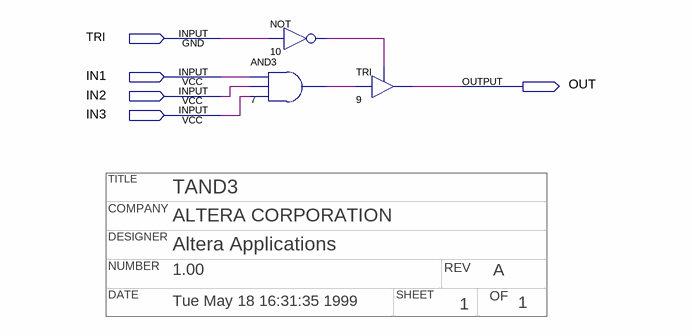
[diagram p0: schematic sheet]
// Quartus schematic tand3.bdf as structural Verilog: 3 symbols, 5 pins
// Title block: TITLE: TAND3; COMPANY: ALTERA CORPORATION; DESIGNER: Altera Applications; NUMBER: 1.00; REV: A; DATE: Tue May 18 16:31:35 1999; SHEET: 1; OF: 1
module tand3 (
  input  TRI,
  input  IN1,
  input  IN2,
  input  IN3,
  output OUT
);

  wire n7_out, n10_out;

  not u_10 (n10_out, TRI);
  and u_7 (n7_out, IN1, IN2, IN3);
  TRI u_9 (.IN(n7_out), .OE(n10_out), .OUT(OUT));
endmodule
